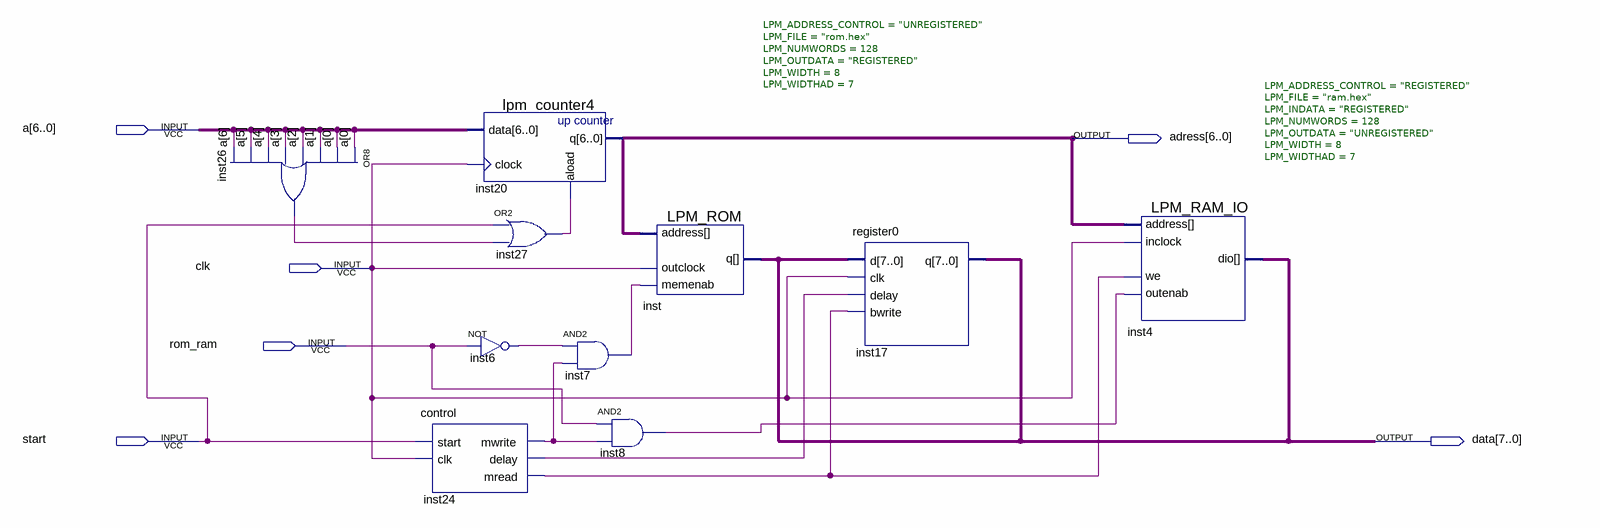
[diagram p0: schematic sheet]
// Quartus schematic lab30.bdf as structural Verilog: 10 symbols, 6 pins
module lab30 (
  input  [6:0] a,
  input  clk,
  input  rom_ram,
  input  start,
  output [6:0] adress,
  output [7:0] data
);

  wire inst6_out, inst7_out, inst8_out, inst24_delay, inst24_mread, inst24_mwrite, inst26_out, inst27_out;

  or inst26 (inst26_out, a[0], a[0], a[1], a[2], a[3], a[4], a[5], a[6]);
  lpm_counter4 inst20 (.data(a), .clock(clk), .aload(inst27_out), .q(adress));
  not inst6 (inst6_out, rom_ram);
  control inst24 (.start(start), .clk(clk), .mwrite(inst24_mwrite), .delay(inst24_delay), .mread(inst24_mread));
  or inst27 (inst27_out, start, inst26_out);
  and inst7 (inst7_out, inst6_out, inst24_mwrite);
  and inst8 (inst8_out, rom_ram, inst24_mwrite);
  LPM_ROM #(.LPM_ADDRESS_CONTROL("UNREGISTERED"), .LPM_FILE("rom.hex"), .LPM_NUMWORDS(128), .LPM_OUTDATA("REGISTERED"), .LPM_WIDTH(8), .LPM_WIDTHAD(7)) inst (
    .address(adress), .outclock(clk), .memenab(inst7_out), .q(data));
  register0 inst17 (.d(data), .clk(clk), .delay(inst24_delay), .bwrite(inst24_mread), .q(data));
  LPM_RAM_IO #(.LPM_ADDRESS_CONTROL("REGISTERED"), .LPM_FILE("ram.hex"), .LPM_INDATA("REGISTERED"), .LPM_NUMWORDS(128), .LPM_OUTDATA("UNREGISTERED"), .LPM_WIDTH(8), .LPM_WIDTHAD(7)) inst4 (
    .address(adress), .inclock(clk), .we(inst24_mread), .outenab(inst8_out), .dio(data));
endmodule
